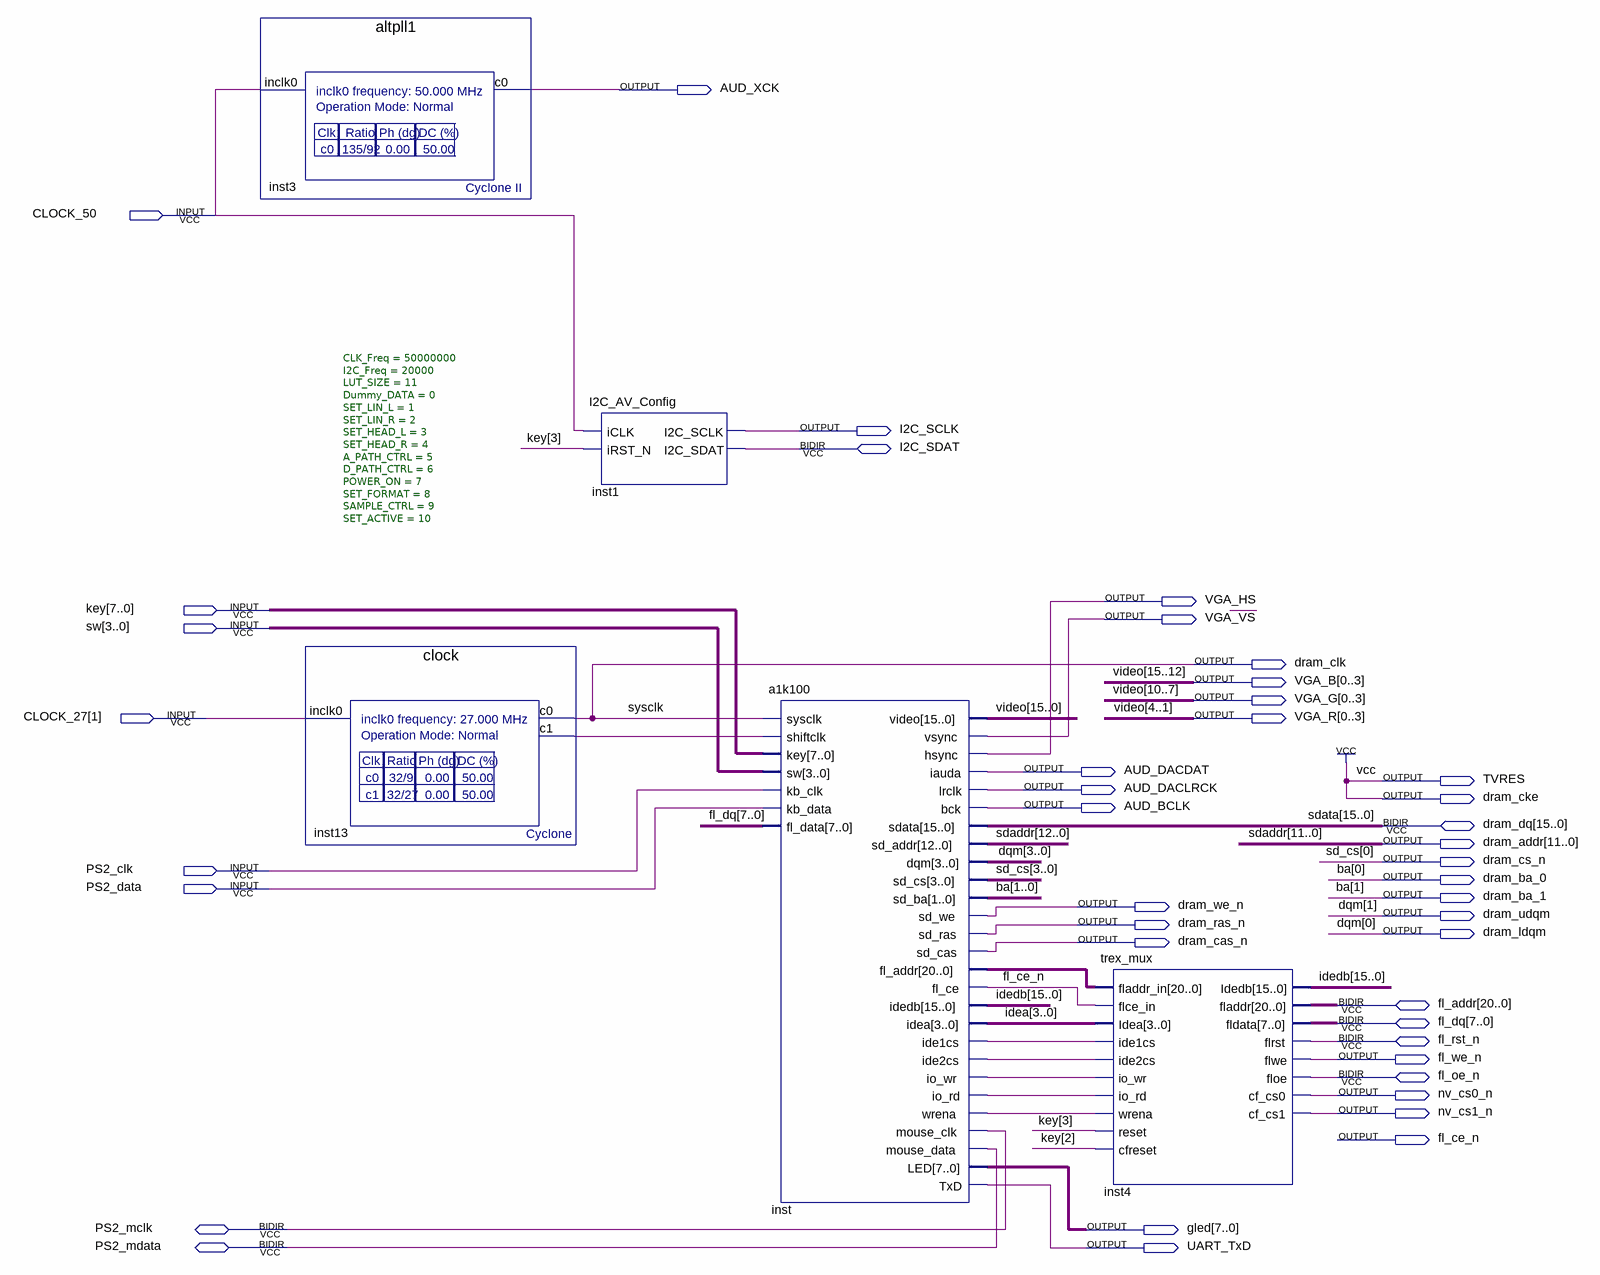
[diagram p0: schematic sheet]
// Quartus schematic turbocpc.bdf as structural Verilog: 5 symbols, 42 pins
module turbocpc (
  input  CLOCK_50,
  input  [7:0] key,
  input  [3:0] sw,
  input  [1:1] CLOCK_27,
  input  PS2_clk,
  input  PS2_data,
  inout  I2C_SDAT,
  inout  [15:0] dram_dq,
  inout  [20:0] fl_addr,
  inout  [7:0] fl_dq,
  inout  fl_rst_n,
  inout  fl_oe_n,
  inout  PS2_mclk,
  inout  PS2_mdata,
  output AUD_XCK,
  output I2C_SCLK,
  output VGA_HS,
  output VGA_VS,
  output dram_clk,
  output [0:3] VGA_B,
  output [0:3] VGA_G,
  output [0:3] VGA_R,
  output AUD_DACDAT,
  output TVRES,
  output AUD_DACLRCK,
  output dram_cke,
  output AUD_BCLK,
  output [11:0] dram_addr,
  output dram_cs_n,
  output dram_ba_0,
  output dram_ba_1,
  output dram_we_n,
  output dram_udqm,
  output dram_ras_n,
  output dram_ldqm,
  output dram_cas_n,
  output fl_we_n,
  output nv_cs0_n,
  output nv_cs1_n,
  output fl_ce_n,
  output [7:0] gled,
  output UART_TxD
);

  wire inst13_c1, inst_ide1cs, inst_ide2cs, inst_io_rd, inst_io_wr, inst_wrena;
  wire [3:0] idea;
  wire [3:1] sd_cs;
  wire [3:2] dqm;
  wire [11:0] video;
  wire [12:12] sdaddr;
  wire [15:0] idedb;
  wire [20:0] inst_fl_addr;

  altpll1 inst3 (.inclk0(CLOCK_50), .c0(AUD_XCK));
  clock inst13 (.inclk0(CLOCK_27[1]), .c0(dram_clk), .c1(inst13_c1));
  I2C_AV_Config #(.CLK_Freq(50000000), .I2C_Freq(20000), .LUT_SIZE(11), .Dummy_DATA(0), .SET_LIN_L(1), .SET_LIN_R(2), .SET_HEAD_L(3), .SET_HEAD_R(4), .A_PATH_CTRL(5), .D_PATH_CTRL(6), .POWER_ON(7), .SET_FORMAT(8), .SAMPLE_CTRL(9), .SET_ACTIVE(10)) inst1 (
    .iCLK(CLOCK_50), .iRST_N(key[3]), .I2C_SCLK(I2C_SCLK), .I2C_SDAT(I2C_SDAT));
  a1k100 inst (
    .sysclk(dram_clk), .shiftclk(inst13_c1), .key(key), .sw(sw), .kb_clk(PS2_clk), .kb_data(PS2_data),
    .fl_data(fl_dq), .video({VGA_B, video[11], VGA_G, video[6:5], VGA_R, video[0]}), .vsync(VGA_VS),
    .hsync(VGA_HS), .iauda(AUD_DACDAT), .lrclk(AUD_DACLRCK), .bck(AUD_BCLK),
    .sd_addr({sdaddr[12], dram_addr}), .dqm({dqm, dram_udqm, dram_ldqm}), .sd_cs({sd_cs, dram_cs_n}),
    .sd_ba({dram_ba_1, dram_ba_0}), .sd_we(dram_we_n), .sd_ras(dram_ras_n), .sd_cas(dram_cas_n),
    .fl_addr(inst_fl_addr), .fl_ce(fl_ce_n), .idea(idea), .ide1cs(inst_ide1cs), .ide2cs(inst_ide2cs),
    .io_wr(inst_io_wr), .io_rd(inst_io_rd), .wrena(inst_wrena), .LED(gled), .TxD(UART_TxD), .sdata(dram_dq),
    .idedb(idedb), .mouse_clk(PS2_mclk), .mouse_data(PS2_mdata));
  trex_mux inst4 (
    .fladdr_in(inst_fl_addr), .flce_in(fl_ce_n), .Idea(idea), .ide1cs(inst_ide1cs), .ide2cs(inst_ide2cs),
    .io_wr(inst_io_wr), .io_rd(inst_io_rd), .wrena(inst_wrena), .reset(key[3]), .cfreset(key[2]),
    .flwe(fl_we_n), .cf_cs0(nv_cs0_n), .cf_cs1(nv_cs1_n), .Idedb(idedb), .fladdr(fl_addr), .fldata(fl_dq),
    .flrst(fl_rst_n), .floe(fl_oe_n));

  assign dram_cke = 1'b1;
  assign TVRES = 1'b1;

  // Other names for the same wires on the sheet: ba[1:0] = {dram_ba_1, dram_ba_0}; dqm[1:0] = {dram_udqm, dram_ldqm};
  //   sysclk = dram_clk; sd_cs[0] = dram_cs_n; sdaddr[11:0] = dram_addr; sdata[15:0] = dram_dq;
  //   video (some bits) = {VGA_B, VGA_G, VGA_R}
endmodule
